# Altium schematic sheet Encodeurs.Schematic.SchDoc
size A
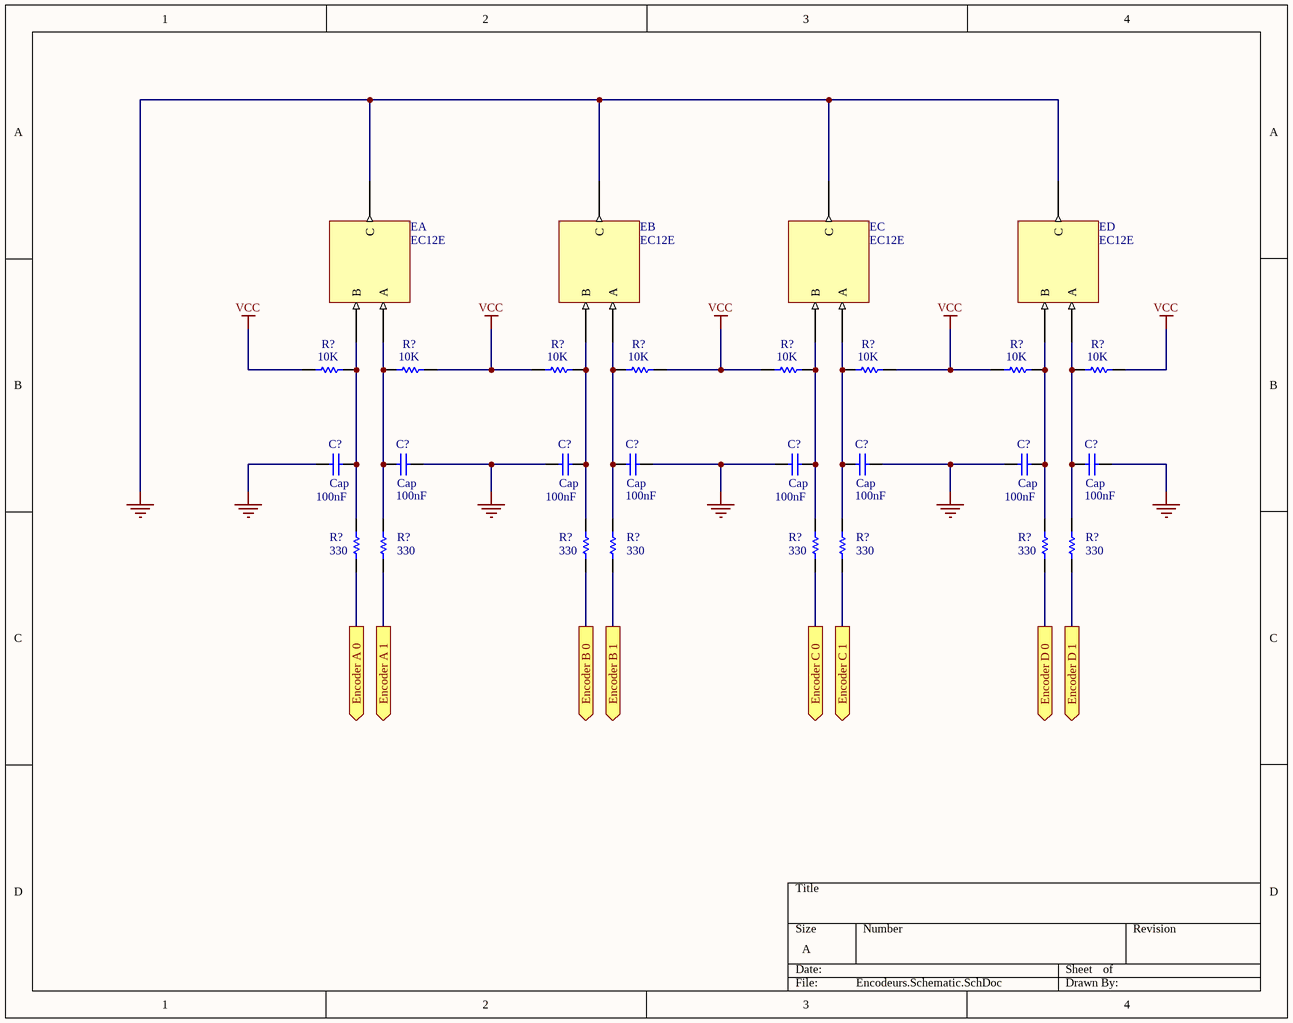
[diagram p0: Encodeurs.Schematic.SchDoc]

## Parts
(Parts that share a designator on the sheet are numbered #1, #2 ... from top to bottom, then left to right.)
C?#1  Cap  value 100nF  [RAD-0.3]
C?#2  Cap  value 100nF  [RAD-0.3]
C?#3  Cap  value 100nF  [RAD-0.3]
C?#4  Cap  value 100nF  [RAD-0.3]
C?#5  Cap  value 100nF  [RAD-0.3]
C?#6  Cap  value 100nF  [RAD-0.3]
C?#7  Cap  value 100nF  [RAD-0.3]
C?#8  Cap  value 100nF  [RAD-0.3]
EA  EC12E
EB  EC12E
EC  EC12E
ED  EC12E
R?#1  10K  [AXIAL-0.3]
R?#2  10K  [AXIAL-0.3]
R?#3  10K  [AXIAL-0.3]
R?#4  10K  [AXIAL-0.3]
R?#5  10K  [AXIAL-0.3]
R?#6  10K  [AXIAL-0.3]
R?#7  10K  [AXIAL-0.3]
R?#8  10K  [AXIAL-0.3]
R?#9  330  [AXIAL-0.3]
R?#10  330  [AXIAL-0.3]
R?#11  330  [AXIAL-0.3]
R?#12  330  [AXIAL-0.3]
R?#13  330  [AXIAL-0.3]
R?#14  330  [AXIAL-0.3]
R?#15  330  [AXIAL-0.3]
R?#16  330  [AXIAL-0.3]

## Ports
Encoder A 0 (out), Encoder A 1 (out), Encoder B 0 (out), Encoder B 1 (out), Encoder C 0 (out), Encoder C 1 (out), Encoder D 0 (out), Encoder D 1 (out)

## Nets
GND: C?#1.1 C?#2.1 C?#3.1 C?#4.1 C?#5.1 C?#6.1 C?#7.1 C?#8.1 EA.GND(C) EB.GND(C) EC.GND(C) ED.GND(C)
VCC: R?#1.1 R?#2.2 R?#3.1 R?#4.2 R?#5.1 R?#6.2 R?#7.1 R?#8.2
Encoder A 0: R?#9.1 ; port Encoder A 0
Encoder A 1: R?#10.1 ; port Encoder A 1
Encoder B 0: R?#11.1 ; port Encoder B 0
Encoder B 1: R?#12.1 ; port Encoder B 1
Encoder C 0: R?#13.1 ; port Encoder C 0
Encoder C 1: R?#14.1 ; port Encoder C 1
Encoder D 0: R?#15.1 ; port Encoder D 0
Encoder D 1: R?#16.1 ; port Encoder D 1
NetC?#1_2: C?#1.2 EA.Pin_B(B) R?#1.2 R?#9.2
NetC?#2_2: C?#2.2 EB.Pin_B(B) R?#3.2 R?#11.2
NetC?#3_2: C?#3.2 EC.Pin_B(B) R?#5.2 R?#13.2
NetC?#4_2: C?#4.2 ED.Pin_B(B) R?#7.2 R?#15.2
NetC?#5_2: C?#5.2 EA.Pin_A(A) R?#2.1 R?#10.2
NetC?#6_2: C?#6.2 EB.Pin_A(A) R?#4.1 R?#12.2
NetC?#7_2: C?#7.2 EC.Pin_A(A) R?#6.1 R?#14.2
NetC?#8_2: C?#8.2 ED.Pin_A(A) R?#8.1 R?#16.2

## Library data of the parts
C?#1-C?#8 = Cap: Capacitor; Published: 8-Jun-2000; LatestRevisionDate: 17-Jul-2002; LatestRevisionNote: Re-released for DXP Platform.; PackageReference: RAD-0.3; Publisher: Altium Limited; PackageDescription: Radial Cap, Thru-Hole; 2 Leads; 0.3 in Pin Spacing
R?#1-R?#8 = Res1: Resistor; Published: 8-Jun-2000; LatestRevisionDate: 17-Jul-2002; LatestRevisionNote: Re-released for DXP Platform.; PackageReference: AXIAL-0.3; Publisher: Altium Limited; PackageDescription: Axial Device, Thru-Hole; 2 Leads; 0.3 in Pin Spacing; Value: 10K
R?#9-R?#16 = Res1: Resistor; Value: 330R; Published: 8-Jun-2000; LatestRevisionDate: 17-Jul-2002; LatestRevisionNote: Re-released for DXP Platform.; PackageReference: AXIAL-0.3; Publisher: Altium Limited; PackageDescription: Axial Device, Thru-Hole; 2 Leads; 0.3 in Pin Spacing